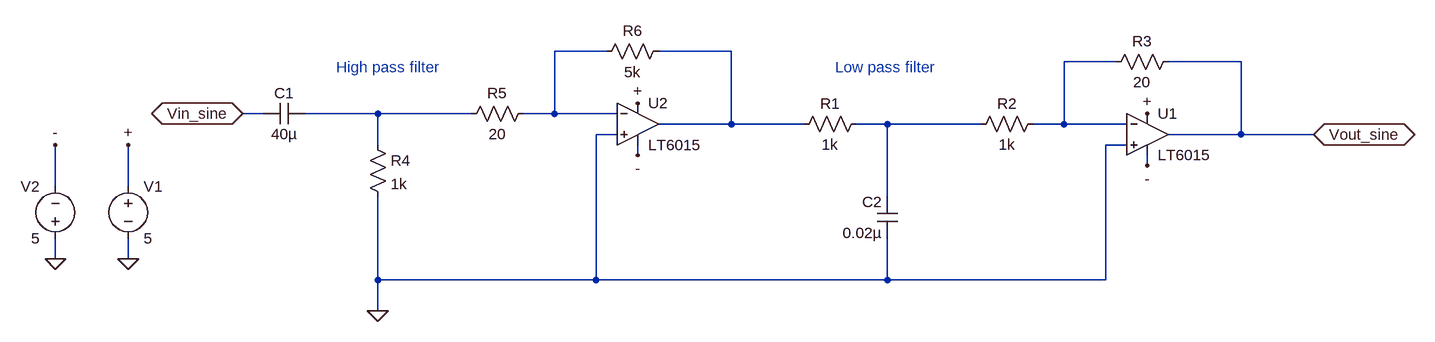
[diagram p0: schematic VCO_Sine.asc]
VCO_Sine.asc, the LTspice schematic file:
Version 4
SHEET 1 2016 804
WIRE 752 -80 672 -80
WIRE 944 -80 832 -80
WIRE 1536 -64 1456 -64
WIRE 1728 -64 1616 -64
WIRE 224 16 192 16
WIRE 400 16 288 16
WIRE 544 16 400 16
WIRE 672 16 672 -80
WIRE 672 16 624 16
WIRE 768 16 672 16
WIRE 944 32 944 -80
WIRE 944 32 832 32
WIRE 1056 32 944 32
WIRE 1184 32 1136 32
WIRE 1328 32 1184 32
WIRE 1456 32 1456 -64
WIRE 1456 32 1408 32
WIRE 1552 32 1456 32
WIRE 768 48 736 48
WIRE 1728 48 1728 -64
WIRE 1728 48 1616 48
WIRE 1840 48 1728 48
WIRE 400 64 400 16
WIRE 1552 64 1520 64
WIRE 800 80 800 64
WIRE 1584 96 1584 80
WIRE -96 128 -96 64
WIRE 16 128 16 64
WIRE 1184 144 1184 32
WIRE -96 240 -96 208
WIRE 16 240 16 208
WIRE 400 272 400 144
WIRE 736 272 736 48
WIRE 736 272 400 272
WIRE 1184 272 1184 208
WIRE 1184 272 736 272
WIRE 1520 272 1520 64
WIRE 1520 272 1184 272
WIRE 400 320 400 272
FLAG 1584 16 +
FLAG 1584 96 -
FLAG 192 16 Vin_sine
IOPIN 192 16 BiDir
FLAG 1840 48 Vout_sine
IOPIN 1840 48 BiDir
FLAG 800 0 +
FLAG 800 80 -
FLAG 16 240 0
FLAG -96 240 0
FLAG 400 320 0
FLAG 16 64 +
FLAG -96 64 -
SYMBOL cap 1200 208 R180
WINDOW 0 24 56 Left 2
WINDOW 3 24 8 Left 2
SYMATTR InstName C2
SYMATTR Value 0.02µ
SYMBOL res 1152 16 R90
WINDOW 0 0 56 VBottom 2
WINDOW 3 32 56 VTop 2
SYMATTR InstName R1
SYMATTR Value 1k
SYMBOL Opamps\\LT6015 1584 48 R0
SYMATTR InstName U1
SYMBOL res 1424 16 R90
WINDOW 0 0 56 VBottom 2
WINDOW 3 32 56 VTop 2
SYMATTR InstName R2
SYMATTR Value 1k
SYMBOL res 1632 -80 R90
WINDOW 0 0 56 VBottom 2
WINDOW 3 32 56 VTop 2
SYMATTR InstName R3
SYMATTR Value 20
SYMBOL cap 288 0 R90
WINDOW 0 0 32 VBottom 2
WINDOW 3 32 32 VTop 2
SYMATTR InstName C1
SYMATTR Value 40µ
SYMBOL res 384 48 R0
SYMATTR InstName R4
SYMATTR Value 1k
SYMBOL Opamps\\LT6015 800 32 R0
SYMATTR InstName U2
SYMBOL res 640 0 R90
WINDOW 0 0 56 VBottom 2
WINDOW 3 32 56 VTop 2
SYMATTR InstName R5
SYMATTR Value 20
SYMBOL res 848 -96 R90
WINDOW 0 0 56 VBottom 2
WINDOW 3 32 56 VTop 2
SYMATTR InstName R6
SYMATTR Value 5k
SYMBOL voltage 16 112 R0
WINDOW 123 0 0 Left 0
WINDOW 39 0 0 Left 0
SYMATTR InstName V1
SYMATTR Value 5
SYMBOL voltage -96 224 R180
WINDOW 0 24 96 Left 2
WINDOW 3 24 16 Left 2
WINDOW 123 0 0 Left 0
WINDOW 39 0 0 Left 0
SYMATTR InstName V2
SYMATTR Value 5
TEXT 336 -56 Left 2 ;High pass filter
TEXT 1104 -56 Left 2 ;Low pass filter

The netlist it stands for:
* VCO_Sine.asc
C2 0 N005 0.02µ
R1 N005 N002 1k
XU1 0 N003 + - Vout_sine LT6016  ; LT6015, pins In+ In- V+ V- OUT
R2 N003 N005 1k
R3 Vout_sine N003 20
C1 N004 Vin_sine 40µ
R4 N004 0 1k
XU2 0 N001 + - N002 LT6016  ; LT6015, pins In+ In- V+ V- OUT
R5 N001 N004 20
R6 N002 N001 5k
V1 + 0 5
V2 0 - 5
* High pass filter
* Low pass filter
.lib LTC2.lib
.backanno
.end